# Altium schematic sheet Relays.SchDoc
size A4; DocumentNumber: 2; SheetNumber: 2; SheetTotal: 4
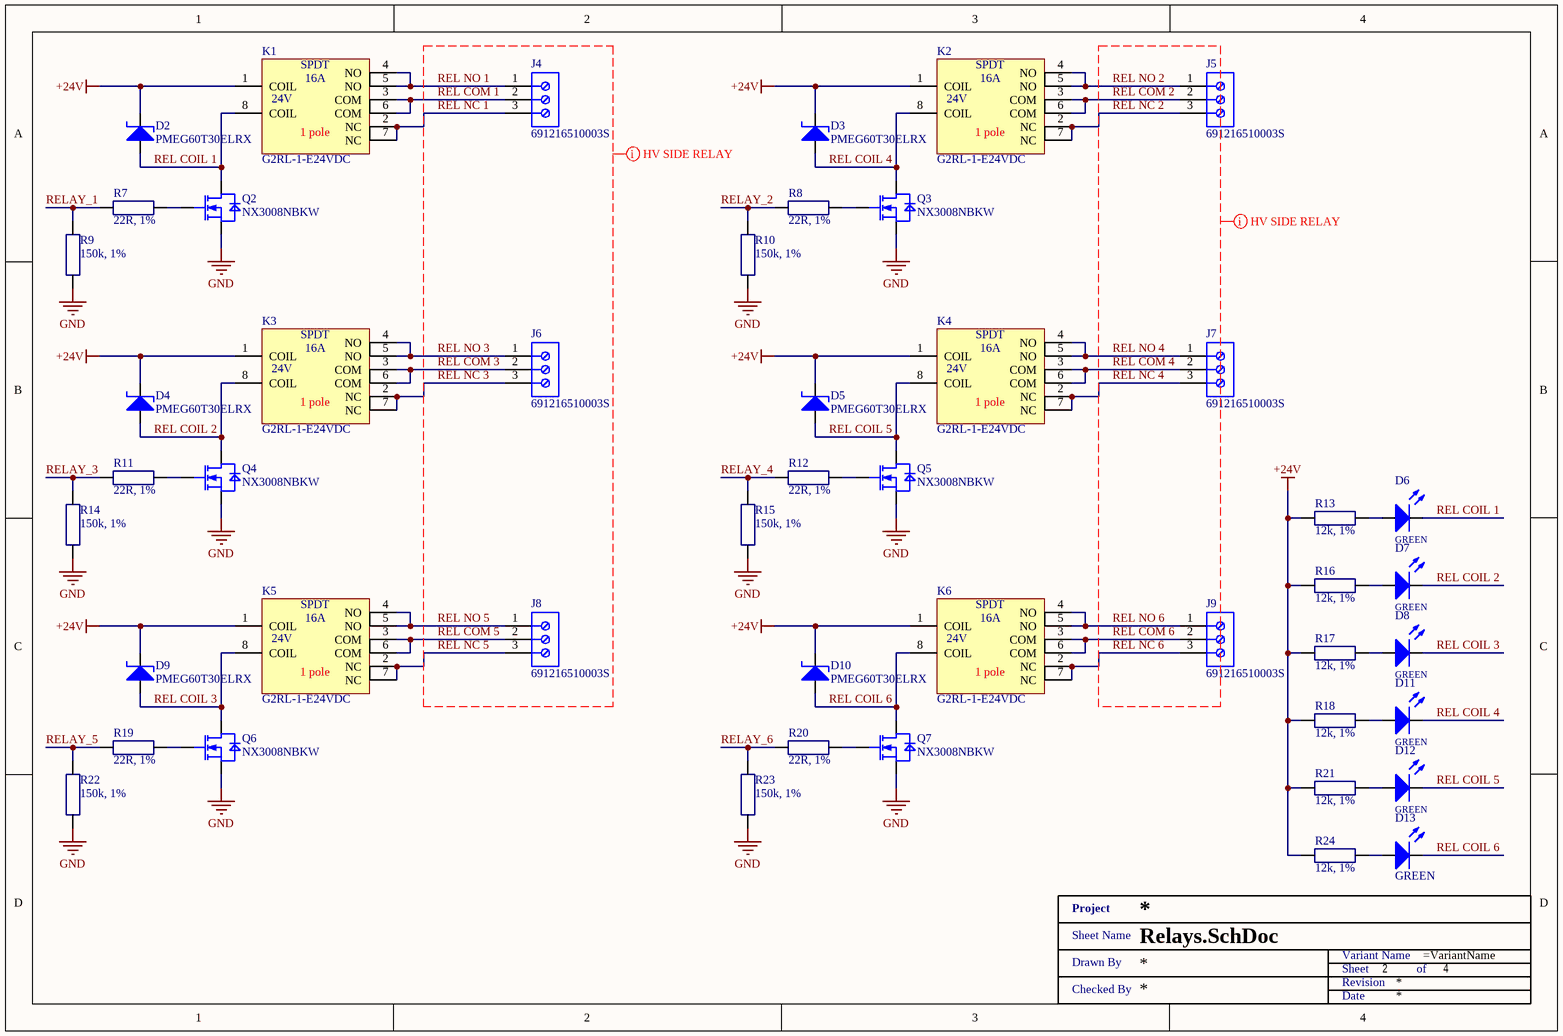
[diagram p0: Relays.SchDoc]

## Parts
D2  PMEG60T30ELRX  [SOD123]
D3  PMEG60T30ELRX  [SOD123]
D4  PMEG60T30ELRX  [SOD123]
D5  PMEG60T30ELRX  [SOD123]
D6  GREEN  [MCL-S270]
D7  GREEN  [MCL-S270]
D8  GREEN  [MCL-S270]
D9  PMEG60T30ELRX  [SOD123]
D10  PMEG60T30ELRX  [SOD123]
D11  GREEN  [MCL-S270]
D12  GREEN  [MCL-S270]
D13  GREEN  [MCL-S270]
J4  691216510003S  [691216510003S]
J5  691216510003S  [691216510003S]
J6  691216510003S  [691216510003S]
J7  691216510003S  [691216510003S]
J8  691216510003S  [691216510003S]
J9  691216510003S  [691216510003S]
K1  G2RL-1-E24VDC  [G2RL]
K2  G2RL-1-E24VDC  [G2RL]
K3  G2RL-1-E24VDC  [G2RL]
K4  G2RL-1-E24VDC  [G2RL]
K5  G2RL-1-E24VDC  [G2RL]
K6  G2RL-1-E24VDC  [G2RL]
Q2  NX3008NBKW  [SOT323]
Q3  NX3008NBKW  [SOT323]
Q4  NX3008NBKW  [SOT323]
Q5  NX3008NBKW  [SOT323]
Q6  NX3008NBKW  [SOT323]
Q7  NX3008NBKW  [SOT323]
R7  22R, 1%  [SMD0603 - R]
R8  22R, 1%  [SMD0603 - R]
R9  150k, 1%  [SMD0603 - R]
R10  150k, 1%  [SMD0603 - R]
R11  22R, 1%  [SMD0603 - R]
R12  22R, 1%  [SMD0603 - R]
R13  12k, 1%  [SMD0603 - R]
R14  150k, 1%  [SMD0603 - R]
R15  150k, 1%  [SMD0603 - R]
R16  12k, 1%  [SMD0603 - R]
R17  12k, 1%  [SMD0603 - R]
R18  12k, 1%  [SMD0603 - R]
R19  22R, 1%  [SMD0603 - R]
R20  22R, 1%  [SMD0603 - R]
R21  12k, 1%  [SMD0603 - R]
R22  150k, 1%  [SMD0603 - R]
R23  150k, 1%  [SMD0603 - R]
R24  12k, 1%  [SMD0603 - R]
XX?  Title 1  (value not drawn)  (graphical)

## Nets
+24V: D2.2(K) D3.2(K) D4.2(K) D5.2(K) D9.2(K) D10.2(K) K1.1(COIL) K2.1(COIL) K3.1(COIL) K4.1(COIL) K5.1(COIL) K6.1(COIL) R13.2 R16.2 R17.2 R18.2 R21.2 R24.2
GND: Q2.2(S) Q3.2(S) Q4.2(S) Q5.2(S) Q6.2(S) Q7.2(S) R9.2 R10.2 R14.2 R15.2 R22.2 R23.2
REL COIL 1: D2.1(A) D6.2(K) K1.8(COIL) Q2.3(D)
REL COIL 2: D4.1(A) D7.2(K) K3.8(COIL) Q4.3(D)
REL COIL 3: D8.2(K) D9.1(A) K5.8(COIL) Q6.3(D)
REL COIL 4: D3.1(A) D11.2(K) K2.8(COIL) Q3.3(D)
REL COIL 5: D5.1(A) D12.2(K) K4.8(COIL) Q5.3(D)
REL COIL 6: D10.1(A) D13.2(K) K6.8(COIL) Q7.3(D)
REL COM 1: J4.2 K1.3(COM) K1.6(COM)
REL COM 2: J5.2 K2.3(COM) K2.6(COM)
REL COM 3: J6.2 K3.3(COM) K3.6(COM)
REL COM 4: J7.2 K4.3(COM) K4.6(COM)
REL COM 5: J8.2 K5.3(COM) K5.6(COM)
REL COM 6: J9.2 K6.3(COM) K6.6(COM)
REL NC 1: J4.3 K1.2(NC) K1.7(NC)
REL NC 2: J5.3 K2.2(NC) K2.7(NC)
REL NC 3: J6.3 K3.2(NC) K3.7(NC)
REL NC 4: J7.3 K4.2(NC) K4.7(NC)
REL NC 5: J8.3 K5.2(NC) K5.7(NC)
REL NC 6: J9.3 K6.2(NC) K6.7(NC)
REL NO 1: J4.1 K1.4(NO) K1.5(NO)
REL NO 2: J5.1 K2.4(NO) K2.5(NO)
REL NO 3: J6.1 K3.4(NO) K3.5(NO)
REL NO 4: J7.1 K4.4(NO) K4.5(NO)
REL NO 5: J8.1 K5.4(NO) K5.5(NO)
REL NO 6: J9.1 K6.4(NO) K6.5(NO)
RELAY_1: R7.1 R9.1
RELAY_2: R8.1 R10.1
RELAY_3: R11.1 R14.1
RELAY_4: R12.1 R15.1
RELAY_5: R19.1 R22.1
RELAY_6: R20.1 R23.1
NetD6_1: D6.1(A) R13.1
NetD7_1: D7.1(A) R16.1
NetD8_1: D8.1(A) R17.1
NetD11_1: D11.1(A) R18.1
NetD12_1: D12.1(A) R21.1
NetD13_1: D13.1(A) R24.1
NetQ2_1: Q2.1(G) R7.2
NetQ3_1: Q3.1(G) R8.2
NetQ4_1: Q4.1(G) R11.2
NetQ5_1: Q5.1(G) R12.2
NetQ6_1: Q6.1(G) R19.2
NetQ7_1: Q7.1(G) R20.2

## Layout directives
net class HV SIDE RELAY: REL COM 1, REL COM 2, REL COM 3, REL COM 4, REL COM 5, REL COM 6, REL NC 1, REL NC 2, REL NC 3, REL NC 4, REL NC 5, REL NC 6, REL NO 1, REL NO 2, REL NO 3, REL NO 4, REL NO 5, REL NO 6

## Notes on the sheet
- (in symbol G2RL-1-E24VDC) 1 pole
- (in symbol Title 1) Project; Sheet Name; Variant Name; Drawn By; Sheet; of; Revision; Checked By; Date

## Library data of the parts
D2-D5 D9 D10 = PMEG60T30ELRX: 60 V, 3 A low leakage current Trench MEGA Schottky barrier rectifier; Manufacturer: Nexperia; Supplier 1: Mouser; Supplier Part Number 1: 771-PMEG60T30ELRX; Manufacturer Part Number: PMEG60T30ELRX; RoHS: No; Stock 1: 115354; Pricing 1: 1=0,46000, 10=0,37500, 50=0,37500, 100=0,25500, 1000=0,14400, 10000=0,11500 (USD); Supplier 2: Farnell; Supplier Part Number 2: 2901049; Supplier 3: Digi-Key; Supplier Part Number 3: 1727-7806-1-ND
D6-D8 D11-D13 = MCL-S270GC: MULTICOMP - MCL-S270GC - LED, 0805, GREEN, 10MCD, 570NM; LED Mounting: SMD; Bulb Size: 1.25mm x 1.4; Forward Current If: 20; Forward Voltage: 2.1; Wavelength Typ: 570; Luminous Intensity: 10; Viewing Angle: 140°; Lens Shape: Rectangular; SVHC: No SVHC (17-Dec-2015); Forward Voltage VF Max: 2.6; LED / Lamp Size: 1.4mm x 1.25; LED Type: Standard; Luminous Intensity Max: 16; Luminous Intensity Min: 4.5; No. of Pins: 2; Peak Forward Current: 100; Peak Wavelength: 568; Reverse Protection Voltage: 5; Voltage Vf Min: 1.7; Voltage Vf Typ: 2.1V<!--FANDB--><div class="features-and-benefits-container"><div class="features-and-benefits-description"><span class="features-benefits-value">The MCL-S270GC is a green SMD LED made of GaP dice. This LED offers water clear rectangular lens and 260°C for 5 seconds lead soldering temperature range 1.6mm from body.</span></div><div class="features-and-benefits-list"><ul class="features-and-benefits-list-list"><li class="features-and-benefits-list-item">-40 to 85; Manufacturer: MULTICOMP; Manufacturer Part Number: MCL-S270GC; RoHS: YES; Stock 1: 80989; Pricing 1: 5=0,145, 25=0,136, 100=0,126, 250=0,0813, 500=0,0645, 2000=0,0559, 5000=0,0496, 20000=0,0434 (GBP); LED Colour: Green; Packaging: Cut Tape; Product Range: -; Automotive Qualification Standard: -; MSL: MSL 3 - 168 hours; Current Rating: 20; Dominant Wavelength: 570; Dominant Wavelength Typ: 570; Forward Current If Max: 20; Luminous Intensity Typ: 10; Operating Temperature Max: 85; Operating Temperature Min: -40; Operating Temperature Range: -40°C to +85; Storage Temperature Max: +100; Storage Temperature Min: -40; ComponentLink1URL: http://www.farnell.com/cad/53028.pdf; ComponentLink1Description: http://www.farnell.com/cad/53028.pdf; ComponentLink2URL: http://www.farnell.com/datasheets/1671537.pdf; ComponentLink2Description: http://www.farnell.com/datasheets/1671537.pdf; Supplier 1: Farnell; Supplier Part Number 1: 1581242; Supplier 2: Newark; Supplier Part Number 2: 14N9356
J4-J9 = 691216510003S: 3 pin WR-TBL Series 2165S - 5.08 mm Horizontal Entry Modular w. Rising Cage Clamp; Manufacturer: Wurth Electronics; Supplier 1: Mouser; Supplier Part Number 1: 710-691216510003S; Manufacturer Part Number: 691216510003S; RoHS: Yes; Category: Terminal Blocks; Stock 1: 1811; Pricing 1: 1=1,51000, 10=1,34000, 50=1,25000, 100=1,15000, 1000=0,85300, 10000=0,85300 (USD); RoHS Compliant: Yes; ComponentLink1URL: http://katalog.we-online.de/em/datasheet/6912165100xxS.pdf?src-supplier=Digi-Key; ComponentLink1Description: http://katalog.we-online.de/em/datasheet/6912165100xxS.pdf?src-supplier=Digi-Key; Supplier 2: Farnell; Supplier Part Number 2: 3767921; Supplier 3: Digi-Key; Supplier Part Number 3: 732-691216510003S-ND
K1-K6 = G2RL-1-E24VDC: Power/Signal Relay, SPDT, Momentary, 0.17A (Coil), 24VDC (Coil), 400mW (Coil), 16A (Contact), 300VDC (Contact), DC Input, AC/DC Output, Through Hole-Straight Mount; Manufacturer: Omron; Coil Current(DC)-Max: 170mA; Coil Operate Voltage(DC): 16.8V; Coil Release Voltage(DC): 2.4V; Coil Resistance: 1.44kR; Coil Voltage(DC)-Max: 24V; Contact AC Max Rating R Load: 16A@440VAC; Contact DC Max Rating R Load: 16A@300VDC; Contact Voltage(AC)-Max: 440V; Contact Voltage(DC)-Max: 300V; Operate Time: 15ms; Release Time: 5ms; Body Breadth: 12.7mm; Body Height: 15.7mm; Body Length or Diameter: 29mm; Reference Standard: UL; Supplier: TME; Supplier Part Number: G2RL-1-E-24DC; Manufacturer Part Number: G2RL-1-E24VDC; RoHS: Yes; Stock: 1286; Pricing: 1=2.11, 5=1.92, 20=1.5 (EUR); Mounting Technology: Through Hole; Min Operating Temperature: -40°C; Max Operating Temperature: 85°C; Coil Power: 400mW; Coil/Input Supply Type: DC; Contact Current(AC)-Max: 16A; Contact Current(DC)-Max: 16A; Contact/Output Supply Type: AC/DC; Relay Action: MOMENTARY; Relay Function: SPDT; Relay Type: POWER/SIGNAL RELAY; Termination: Solder; Reach SVHC Compliant: Yes; RoHS Compliant: Yes; ComponentLink1URL: https://datasheet.ciiva.com:443/pdfs/VipMasterIC/IC/OMRN/OMRN-S-A0001723434/OMRN-S-A0001723434-1.pdf?src-supplier=IHS+Markit; ComponentLink1Description: https://datasheet.ciiva.com:443/pdfs/VipMasterIC/IC/OMRN/OMRN-S-A0001723434/OMRN-S-A0001723434-1.pdf?src-supplier=IHS+Markit; ComponentLink2URL: https://datasheet.ciiva.com/14146/dhrelay-technik-e-14146598.pdf?src-supplier=Distrelec; ComponentLink2Description: https://datasheet.ciiva.com/14146/dhrelay-technik-e-14146598.pdf?src-supplier=Distrelec
Q2-Q7 = NX3008NBKW: NXP - NX3008NBKW - MOSFET, N CH, 30V, 350MA, SOT323; Transistor Polarity: N Channel; Continuous Drain Current Id: 350; Drain Source Voltage Vds: 30; On Resistance Rds(on): 1; Rds(on) Test Voltage Vgs: 4.5; Threshold Voltage Vgs: 900; Power Dissipation Pd: 260; Transistor Case Style: SOT-323; No. of Pins: 3; SVHC: No SVHC (17-Dec-2015); Pulse Current Idm: -0.8; Voltage Vgs th Max: 8; Manufacturer: NXP; Manufacturer Part Number: NX3008NBKW; RoHS: YES; Stock 1: 4764; Pricing 1: 1=0.0425, 25=0.0385, 100=0.0347, 250=0.0334, 500=0.0312, 2000=0.0291, 4000=0.0282, 20000=0.0273 (GBP); Operating Temperature Max: 150; Product Range: -; Automotive Qualification Standard: -; MSL: MSL 1 - Unlimited; Operating Temperature Min: -55; Operating Temperature Range: -55°C to +150; ComponentLink1URL: http://www.farnell.com/datasheets/1508392.pdf; ComponentLink1Description: http://www.farnell.com/datasheets/1508392.pdf; Supplier 1: Mouser; Supplier Part Number 1: 771-NX3008NBKW,115; Supplier 2: Farnell; Supplier Part Number 2: 2069546; Supplier 3: Arrow; Supplier Part Number 3: NX3008NBKW,115
R7 R8 R11 R12 R19 R20 = RC0603FR-0722RL: YAGEO (PHYCOMP) - RC0603FR-0722RL - RES, THICK FILM, 22R, 1%, 0.1W, 0603; Voltage Rating: 50; Resistor Case Style: 0603 [1608 Metric]; Power Rating: 100; Product Range: RC Series; Temperature Coefficient: ± 100; SVHC: No SVHC (20-Jun-2016); External Depth: 0.45; External Length / Height: 1.6; External Width: 0.8; Full Power Rating Temperature: 70; No. of Pins: 2; Reel Quantity: 5000; Resistor Mounting: Surface Mount Device; Voltage Rating V DC: 50V<!--FANDB--><div class="features-and-benefits-container"><div class="features-and-benefits-desc-container"><span class="features-and-benefits-container-desc">SMD Chip Resistor, Thick Film, 22 ohm, 50 V, 0603 [1608 Metric], 100 mW, ± 1%, RC Series</span></div><div class="features-and-benefits-description"><span class="features-benefits-value">The Yageo RC_L series resistors are general purpose thick film chip resistors with lead free terminations made by thick film process. The resistance range includes E24 and E96 decade values from 1ohm to 100Mohm. These resistors are constructed on top of a high grade ceramic body.</span></div><div class="features-and-benefits-list"><ul class="features-and-benefits-list-list"><li class="features-and-benefits-list-item">EIA 0075, 0100, 0201, 0402, 0603, 0805, 1206, 1210, 1218, 2010, 2512 case sizes available</li><li class="features-and-benefits-list-item">Small chip sizes save PCB space</li><li class="features-and-benefits-list-item">Rated voltage range of 10V to 200V</li><li class="features-and-benefits-list-item">Maximum power rating of 2W</li><li class="features-and-benefits-list-item">Available in ±0.1%, ±0.5%, ±1% and ±5% tolerance</li><li class="features-and-benefits-list-item">High component and equipment reliability</li><li class="features-and-benefits-list-item">Forbidden materials are not used in products/production</li><li class="features-and-benefits-list-item">-55°C to 155°C temperature range for RC0402 to RC2512 and -55°C to 125°C for RC0075 to RC0201; Manufacturer: YAGEO (PHYCOMP); Manufacturer Part Number: RC0603FR-0722RL; RoHS: YES; Stock 1: 33025; Pricing 1: 10=0.0102, 100=0.0068, 500=0.0051, 1000=0.0041, 2500=0.0034 (GBP); Resistance: 22R; Resistance Tolerance: ± 1%; Packaging: Cut Tape; Resistor Element Material: Thick Film; Automotive Qualification Standard: -; MSL: MSL 1 - Unlimited; Operating Temperature Max: 155; Operating Temperature Min: -55; Operating Temperature Range: -55°C to +155; Temperature Coeff. +: 100; Temperature Coeff. -: 100; Tolerance +: 1%; Tolerance -: 1%; ComponentLink1URL: http://www.farnell.com/datasheets/2167052.pdf; ComponentLink1Description: http://www.farnell.com/datasheets/2167052.pdf; ComponentLink2URL: http://www.farnell.com/cad/1555248.zip; ComponentLink2Description: http://www.farnell.com/cad/1555248.zip; Supplier 1: Mouser; Supplier Part Number 1: 603-RC0603FR-0722RL; Supplier 2: Farnell; Supplier Part Number 2: 9238280; Supplier 3: Digi-Key; Supplier Part Number 3: 311-22.0HRCT-ND
R9 R10 R14 R15 R22 R23 = RC0603FR-07150KL: YAGEO - RC0603FR-07150KL - RES, 150K, 1%, 0.1W, 0603, THICK FILM; Product Range: RC Series; Voltage Rating: 75; Resistor Case Style: 0603 [1608 Metric]; Power Rating: 100; Temperature Coefficient: ± 100; SVHC: No SVHC (27-Jun-2018); External Depth: 0.45; External Length / Height: 1.6; External Width: 0.8; Full Power Rating Temperature: 70; No. of Pins: 2; Reel Quantity: 5000; Resistor Mounting: Surface Mount Device; Voltage Rating V DC: 50V<!--FANDB--><div class="features-and-benefits-container"><div class="features-and-benefits-desc-container"><span class="features-and-benefits-container-desc">SMD Chip Resistor, 150 kohm, RC Series, 75 V, Thick Film, 0603 [1608 Metric], 100 mW</span></div><div class="features-and-benefits-description"><span class="features-benefits-value">The Yageo RC_L series resistors are general purpose thick film chip resistors with lead free terminations made by thick film process. The resistance range includes E24 and E96 decade values from 1ohm to 100Mohm. These resistors are constructed on top of a high grade ceramic body.</span></div><div class="features-and-benefits-list"><ul class="features-and-benefits-list-list"><li class="features-and-benefits-list-item">EIA 0075, 0100, 0201, 0402, 0603, 0805, 1206, 1210, 1218, 2010, 2512 case sizes available</li><li class="features-and-benefits-list-item">Small chip sizes save PCB space</li><li class="features-and-benefits-list-item">Rated voltage range of 10V to 200V</li><li class="features-and-benefits-list-item">Maximum power rating of 2W</li><li class="features-and-benefits-list-item">Available in ±0.1%, ±0.5%, ±1% and ±5% tolerance</li><li class="features-and-benefits-list-item">High component and equipment reliability</li><li class="features-and-benefits-list-item">Forbidden materials are not used in products/production</li><li class="features-and-benefits-list-item">-55°C to 155°C temperature range for RC0402 to RC2512 and -55°C to 125°C for RC0075 to RC0201; Manufacturer: YAGEO; Manufacturer Part Number: RC0603FR-07150KL; RoHS: YES; Pricing 1: 10=0.678, 100=0.557, 500=0.39, 1000=0.326, 2500=0.244 (EUR); Resistance: 150k; Resistor Element Material: Thick Film; Resistance Tolerance: ± 1%; Automotive Qualification Standard: -; MSL: MSL 1 - Unlimited; Operating Temperature Max: 155; Operating Temperature Min: -55; Operating Temperature Range: -55°C to +155; Temperature Coeff. +: 100; Temperature Coeff. -: 100; Tolerance +: 1%; Tolerance -: 1%; ComponentLink1URL: http://www.farnell.com/datasheets/2167052.pdf; ComponentLink1Description: http://www.farnell.com/datasheets/2167052.pdf; ComponentLink2URL: http://www.farnell.com/cad/1555201.zip; ComponentLink2Description: http://www.farnell.com/cad/1555201.zip; Supplier 1: Mouser; Supplier Part Number 1: 603-RC0603FR-07150KL; Supplier 2: Farnell; Supplier Part Number 2: 9238743; Supplier 3: Digi-Key; Supplier Part Number 3: 311-150KHRCT-ND
R13 R16-R18 R21 R24 = RCS060312K0FKEA: RES SMD 12K OHM 1% 1/4W 0603; Manufacturer: Vishay Dale; Power (Watts): 0.25W, 1/4W; Temperature Coefficient: ±100ppm/°C; Manufacturer Part Number: RCS060312K0FKEA; RoHS: RoHS Compliant; Category: Resistors; Stock 1: 0; Pricing 1: 5000=0.01664, 10000=0.01513 (USD); Packaging: Tape & Reel (TR); Part Status: Active; Tolerance: ±1%; Composition: Thick Film; Features: Automotive AEC-Q200, Pulse Withstanding; Operating Temperature: -55°C ~ 155°C; Package / Case: 0603 (1608 Metric); Supplier Device Package: 0603; Size / Dimension: 0.061" L x 0.033" W (1.55mm x 0.85mm); Height - Seated (Max): 0.020" (0.50mm); Failure Rate: -; ComponentLink1URL: http://www.vishay.com/docs/20065/rcse3.pdf; ComponentLink1Description: http://www.vishay.com/docs/20065/rcse3.pdf; Resistance: 12k; Supplier 1: Mouser; Supplier Part Number 1: 71-RCS060312K0FKEA; Supplier 2: Farnell; Supplier Part Number 2: 3294375; Supplier 3: Digi-Key; Supplier Part Number 3: RCS060312K0FKEA-ND